# EAGLE design Macro_Mini_keypad (EAGLE 9.6.2)
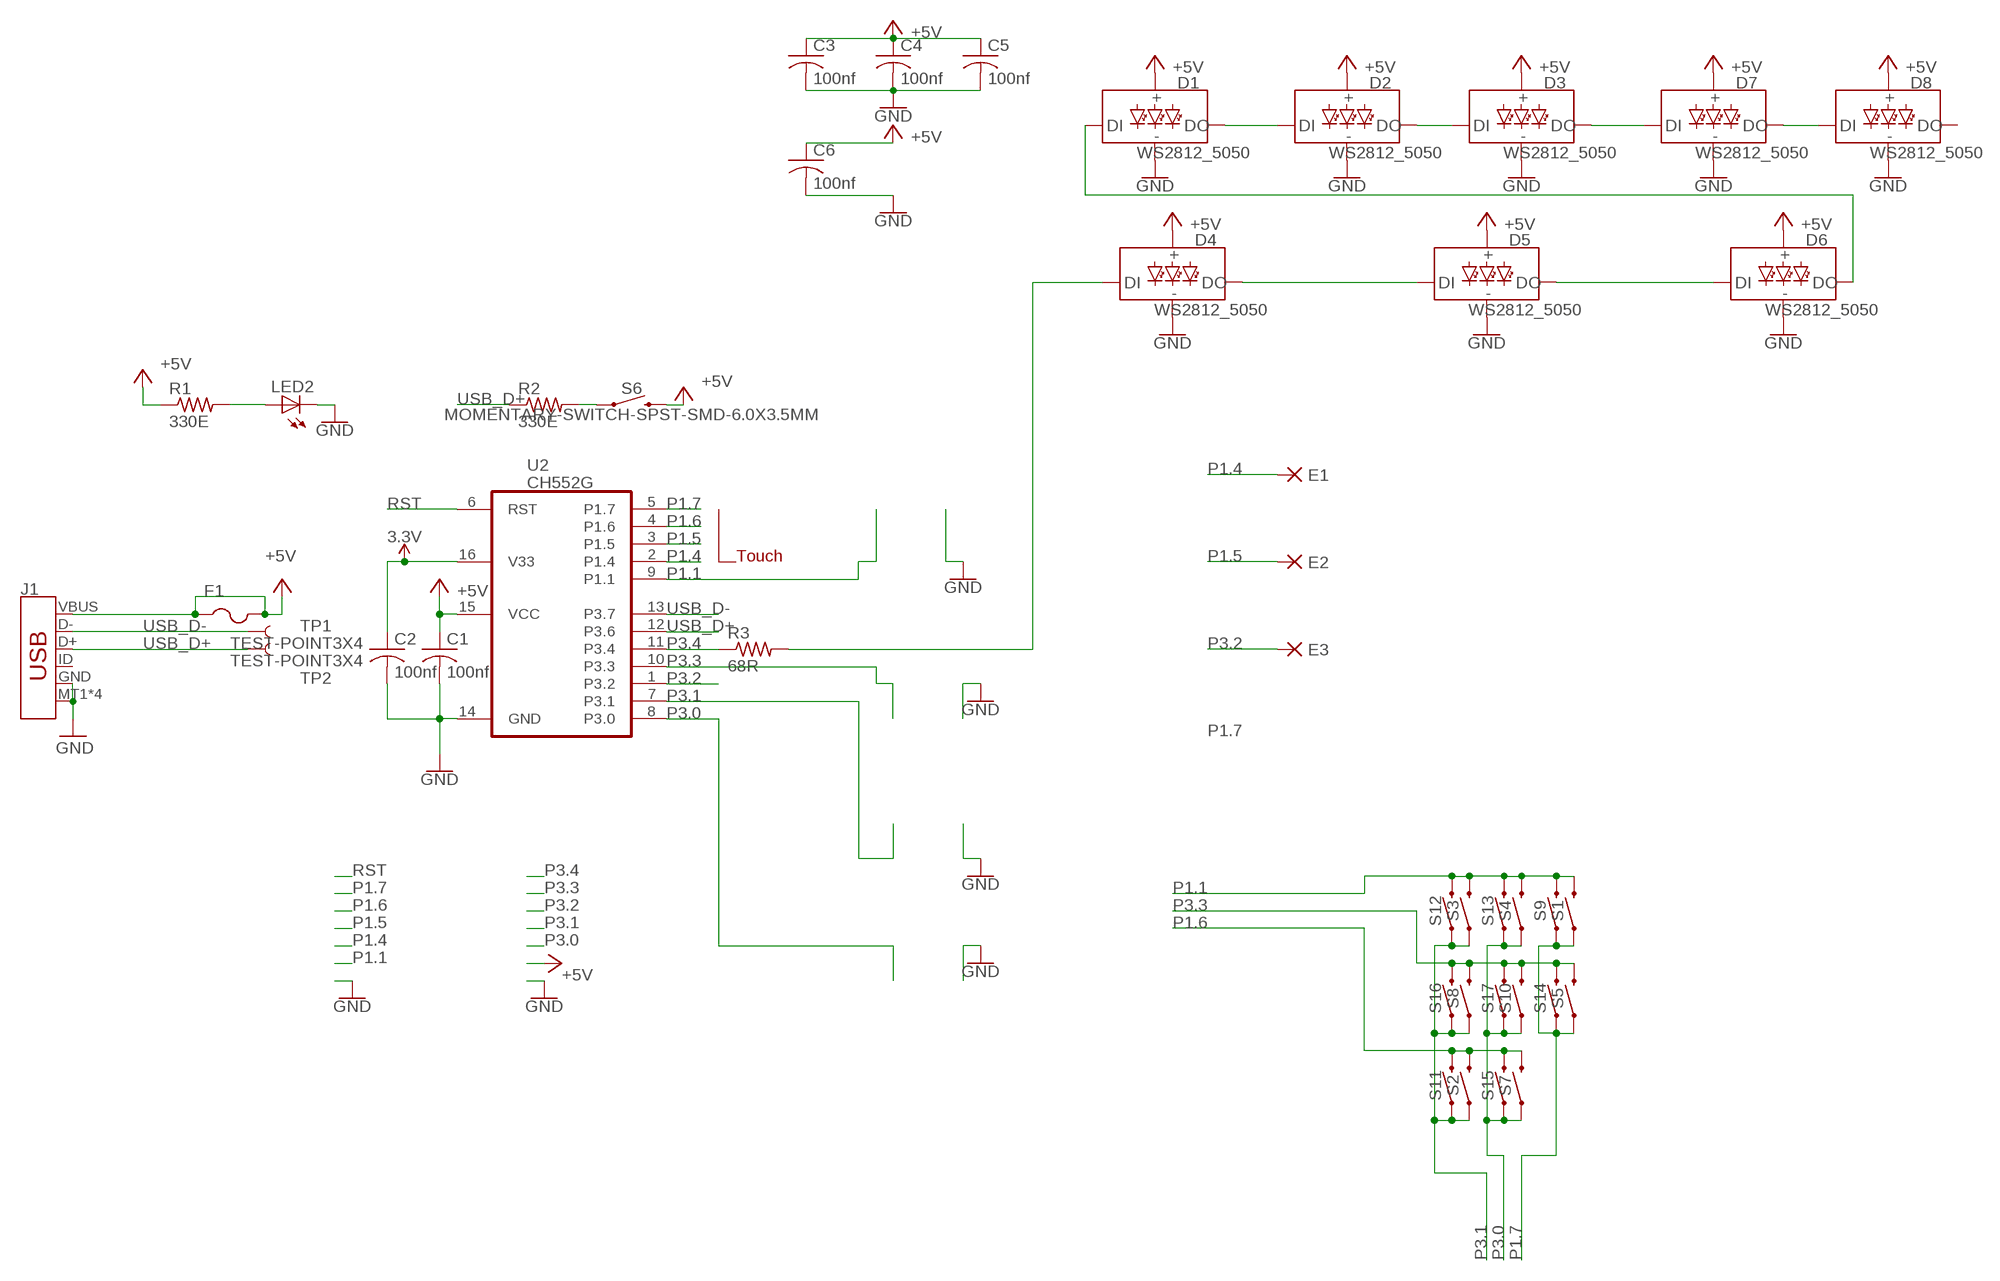
[diagram p0: schematic, sheet 1]

## Parts
C1  100nf  C-USC1206  [C1206]
C2  100nf  C-USC1206  [C1206]
C3  100nf  C-USC1206  [C1206]
C4  100nf  C-USC1206  [C1206]
C5  100nf  C-USC1206  [C1206]
C6  100nf  C-USC1206  [C1206]
D1  WS2812_5050  [WS2812-5X5-4PIN]
D2  WS2812_5050  [WS2812-5X5-4PIN]
D3  WS2812_5050  [WS2812-5X5-4PIN]
D4  WS2812_5050  [WS2812-5X5-4PIN]
D5  WS2812_5050  [WS2812-5X5-4PIN]
D6  WS2812_5050  [WS2812-5X5-4PIN]
D7  WS2812_5050  [WS2812-5X5-4PIN]
D8  WS2812_5050  [WS2812-5X5-4PIN]
E1  DPADS_PAD-0400-S  [DPADS_0400-S]
E2  DPADS_PAD-0400-S  [DPADS_0400-S]
E3  DPADS_PAD-0400-S  [DPADS_0400-S]
F1  PTCFUSE-1206  [R1206]
J1  USB_MICRO-B_SMT  [USB-MICROB]
LED2  LEDCHIPLED_1206  [CHIPLED_1206]
R1  330E  R-US_R1206  [R1206]
R2  330E  R-US_R1206  [R1206]
R3  68R  R-US_R1206  [R1206]
S1  MECHANICAL-KEYBOARD_CUSTOM1U  [CHERRY-MX-LED-1U]
S2  MECHANICAL-KEYBOARD_CUSTOM1U  [CHERRY-MX-LED-1U]
S3  MECHANICAL-KEYBOARD_CUSTOM1U  [CHERRY-MX-LED-1U]
S4  MECHANICAL-KEYBOARD_CUSTOM1U  [CHERRY-MX-LED-1U]
S5  MECHANICAL-KEYBOARD_CUSTOM1U  [CHERRY-MX-LED-1U]
S6  MOMENTARY-SWITCH-SPST-SMD-6.0X3.5MM  [TACTILE_SWITCH_SMD_6.0X3.5MM]
S7  MECHANICAL-KEYBOARD_CUSTOM1U  [CHERRY-MX-LED-1U]
S8  MECHANICAL-KEYBOARD_CUSTOM1U  [CHERRY-MX-LED-1U]
S9  MOMENTARY-SWITCH-SPST-PTH-12MM  [TACTILE_SWITCH_PTH_12MM]
S10  MECHANICAL-KEYBOARD_CUSTOM1U  [CHERRY-MX-LED-1U]
S11  MOMENTARY-SWITCH-SPST-PTH-12MM  [TACTILE_SWITCH_PTH_12MM]
S12  MOMENTARY-SWITCH-SPST-PTH-12MM  [TACTILE_SWITCH_PTH_12MM]
S13  MOMENTARY-SWITCH-SPST-PTH-12MM  [TACTILE_SWITCH_PTH_12MM]
S14  MOMENTARY-SWITCH-SPST-PTH-12MM  [TACTILE_SWITCH_PTH_12MM]
S15  MOMENTARY-SWITCH-SPST-PTH-12MM  [TACTILE_SWITCH_PTH_12MM]
S16  MOMENTARY-SWITCH-SPST-PTH-12MM  [TACTILE_SWITCH_PTH_12MM]
S17  MOMENTARY-SWITCH-SPST-PTH-12MM  [TACTILE_SWITCH_PTH_12MM]
TP1  TEST-POINT3X4  [PAD.03X.04]
TP2  TEST-POINT3X4  [PAD.03X.04]
U2  CH552G  MY_IC_CH551G_CH552GSOP-16  [MY_IC_SO16]

## Nets
3.3V: C2.1 U2.16(V33)
+5V: C1.1 C3.1 C4.1 C5.1 C6.1 D1.VCC D2.VCC D3.VCC D4.VCC D5.VCC D6.VCC D7.VCC D8.VCC F1.1 F1.2 J1.VBUS R1.1 S6.2 U2.15(VCC)
GND: C1.2 C2.2 C3.2 C4.2 C5.2 C6.2 D1.GND D2.GND D3.GND D4.GND D5.GND D6.GND D7.GND D8.GND J1.GND J1.MT1(SHIELD) J1.MT2(SHIELD) J1.P$1(SHIELD) J1.P$2(SHIELD) LED2.C U2.14(GND)
N$1: R2.2 S6.1
N$2: D4.DI R3.2
N$3: LED2.A R1.2
N$4: D4.DO D5.DI
N$5: D5.DO D6.DI
N$6: D1.DI D6.DO
N$7: D1.DO D2.DI
N$8: D2.DO D3.DI
N$9: D3.DO D7.DI
N$10: D7.DO D8.DI
P1.1: S1.S2 S3.S2 S4.S2 S9.3 S12.3 S13.3 U2.9(P1.1)
P1.4: E1.PAD(P) U2.2(P1.4)
P1.5: E2.PAD(P) U2.3(P1.5)
P1.6: S2.S2 S7.S2 S11.3 S15.3 U2.4(P1.6)
P1.7: S1.S1 S5.S1 S9.1 S14.1 U2.5(P1.7)
P3.0: S4.S1 S7.S1 S10.S1 S13.1 S15.1 S17.1 U2.8(P3.0)
P3.1: S2.S1 S3.S1 S8.S1 S11.1 S12.1 S16.1 U2.7(P3.1)
P3.2: E3.PAD(P) U2.1(P3.2)
P3.3: S5.S2 S8.S2 S10.S2 S14.3 S16.3 S17.3 U2.10(P3.3)
P3.4: R3.1 U2.11(P3.4)
RST: U2.6(RST)
USB_D+: J1.D+ R2.1 TP2.P$1 U2.12(P3.6)
USB_D-: J1.D- TP1.P$1 U2.13(P3.7)
Unconnected: D8.DO J1.ID

## Notes on the sheet
- Touch

## Library data of the parts
C1-C6 = adafruit:C-US: CAPACITOR, American symbol
D1-D8 = SparkFun-LED:WS2812: Addressable RGB LED - 1 Wire Common names: WS2812, SK6812, Neopixel, APA-106, etc. SMD LED with built-in controller IC. Color: Red/Green/Blue SparkFun Products: LED-SMD RGB (WS2812) <https://www.sparkfun.com/products/11821> LED - RGB Addressable, PTH, 5mm Diffused (5 Pack) <https://www.sparkfun.com/products/12986> LED - RGB Addressable, PTH, 5mm Clear (5 Pack) <https://www.sparkfun.com/products/12999> Blynk Board - ESP8266 <https://www.sparkfun.com/products/13794> Datasheet referenced for footprint: WS2812B-PTH <https://cdn.sparkfun.com/datasheets/Components/LED/COM-12877.pdf>; PROD_ID: DIO-12503
E1-E3 = 52101-101-REV-A_v16:DPADS_PAD: WIRE PAD Standard US Drill Sizes and SMD pads; BOM: EXCLUDE
F1 = adafruit:PTCFUSE: PTC fuses, resettable thermistors; LCSC: C151162
J1 = SparkFun-Connectors:USB_MICRO-B: USB Type Micro-B Connector Male/female and PTH/SMT variants SparkFun Products: SparkFun microB USB Breakout <https://www.sparkfun.com/products/12035> SparkFun USB microB Plug Breakout <https://www.sparkfun.com/products/10031> SparkFun ESP8266 Thing <https://www.sparkfun.com/products/13231>; PROD_ID: CONN-09505; SF_ID: PRT-08533
LED2 = adafruit:LED: LED OSRAM: - CHIPLED LG R971, LG N971, LY N971, LG Q971, LY Q971, LO R971, LY R971 LH N974, LH R974 LS Q976, LO Q976, LY Q976 LO Q996 - Hyper CHIPLED LW Q18S LB Q993, LB Q99A, LB R99A - SideLED LS A670, LO A670, LY A670, LG A670, LP A670 LB A673, LV A673, LT A673, LW A673 LH A674 LY A675 LS A676, LA A676, LO A676, LY A676, LW A676 LS A679, LY A679, LG A679 - Hyper Micro SIDELED® LS Y876, LA Y876, LO Y876, LY Y876 LT Y87S - SmartLED LW L88C, LW L88S LB L89C, LB L89S, LG L890 LS L89K, LO L89K, LY L89K LS L896, LA L896, LO L896, LY L896 - TOPLED LS T670, LO T670, LY T670, LG T670, LP T670 LSG T670, LSP T670, LSY T670, LOP T670, LYG T670 LG T671, LOG T671, LSG T671 LB T673, LV T673, LT T673, LW T673 LH T674 LS T676, LA T676, LO T676, LY T676, LB T676, LH T676, LSB T676, LW T676 LB T67C, LV T67C, LT T67C, LS T67K, LO T67K, LY T67K, LW E67C LS E67B, LA E67B, LO E67B, LY E67B, LB E67C, LV E67C, LT E67C LW T67C LS T679, LY T679, LG T679 LS T770, LO T770, LY T770, LG T770, LP T770 LB T773, LV T773, LT T773, LW T773 LH T774 LS E675, LA E675, LY E675, LS T675 LS T776, LA T776, LO T776, LY T776, LB T776 LHGB T686 LT T68C, LB T68C - Hyper Mini TOPLED® LB M676 - Mini TOPLED Santana® LG M470 LS M47K, LO M47K, LY M47K Source: http://www.osram.convergy.de/
R1-R3 = adafruit:R-US_: RESISTOR, American symbol
S1-S5 S7 S8 S10 = SparkFun-Switches:MECHANICAL-KEYBOARD_CUSTOM: Mechanical Keyboard Spacings for Cherry-MX Cherry-MX w/ LED switch footprints. Each package variant contains a bounding box on the tDocu layer for proper key spacing and a dimensional drawing on the Reference layer to be exported for laser cut mounting plates. Footprints are off-center so that the origin lies on the lower left corner of the key-spacing. This allows for most common layouts to be easily acheived on a grid spacing of 0.1875" Variants 1U through 1.75U in .25U steps Centered switch cutout in SwitchPlate layer with no stabilizers 2U through 2.75U in .25U steps Centered switch cutout in SwitchPlate layer with Cherry+Costar stabilizer holes 6.25U Common spacebar size Centered switch cutout in SwitchPlate layer with Cherry+Costar stabilizer holes "Big Ass" Enter ANSI 104 "Big Ass" Enter Key layout ISO Enter ISO style Enter Key layout
S6 = SparkFun-Switches:MOMENTARY-SWITCH-SPST: Momentary Switch (Pushbutton) - SPST; PROD_ID: SWCH-14278; SF_SKU: COM-08229
S9 S11-S17 = SparkFun-Switches:MOMENTARY-SWITCH-SPST: Momentary Switch (Pushbutton) - SPST; PROD_ID: SWCH-09185; SF_SKU: COM-09190
TP1 TP2 = SparkFun-Connectors:TEST-POINT: SparkFun Test Points Bare copper test points for troubleshooting or In-Circuit-Testing. These are used by our Production team for verifying production board runs using pogo-pins on test beds. SparkFun Products: SparkFun LSM9DS1 Breakout <https://www.sparkfun.com/products/13284> SparkFun PSOC <https://www.sparkfun.com/products/13714> SparkFun Load Cell Amplifier <https://www.sparkfun.com/products/13879>
U2 = myOwnLib:MY_IC_CH551G_CH552G; LCSC: C111292

## Board
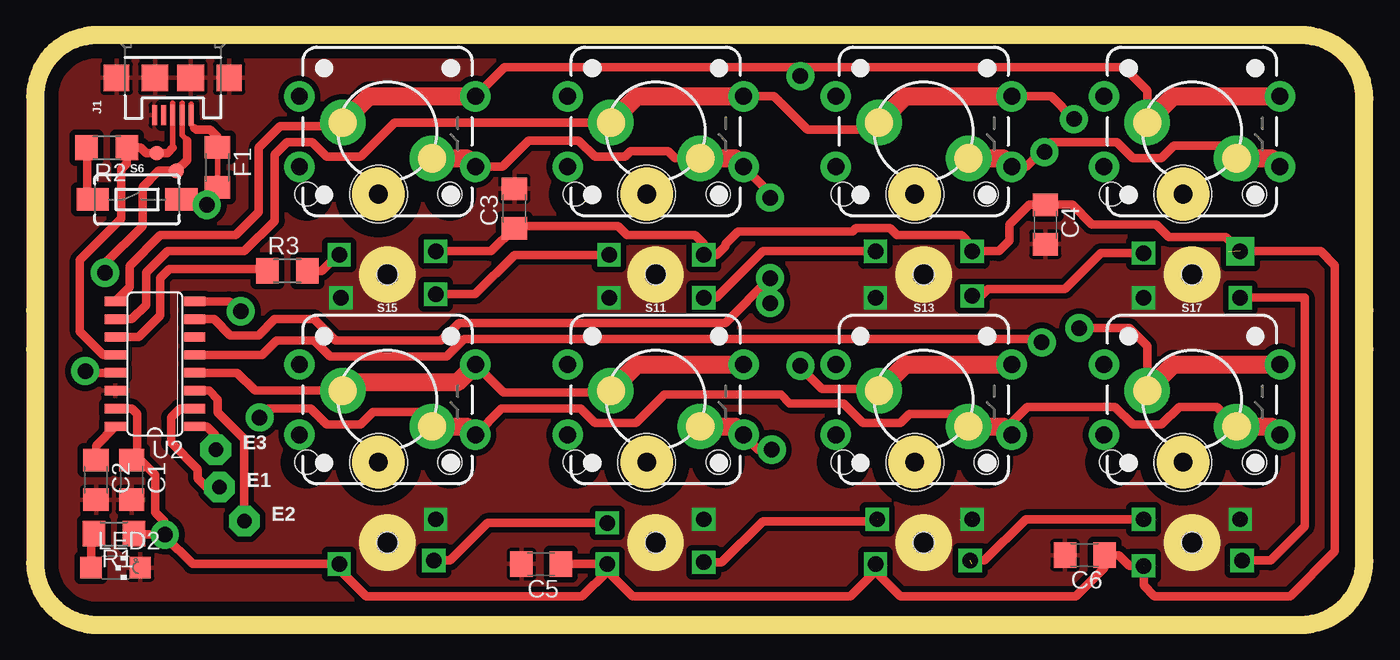
[diagram p1: board, top side]
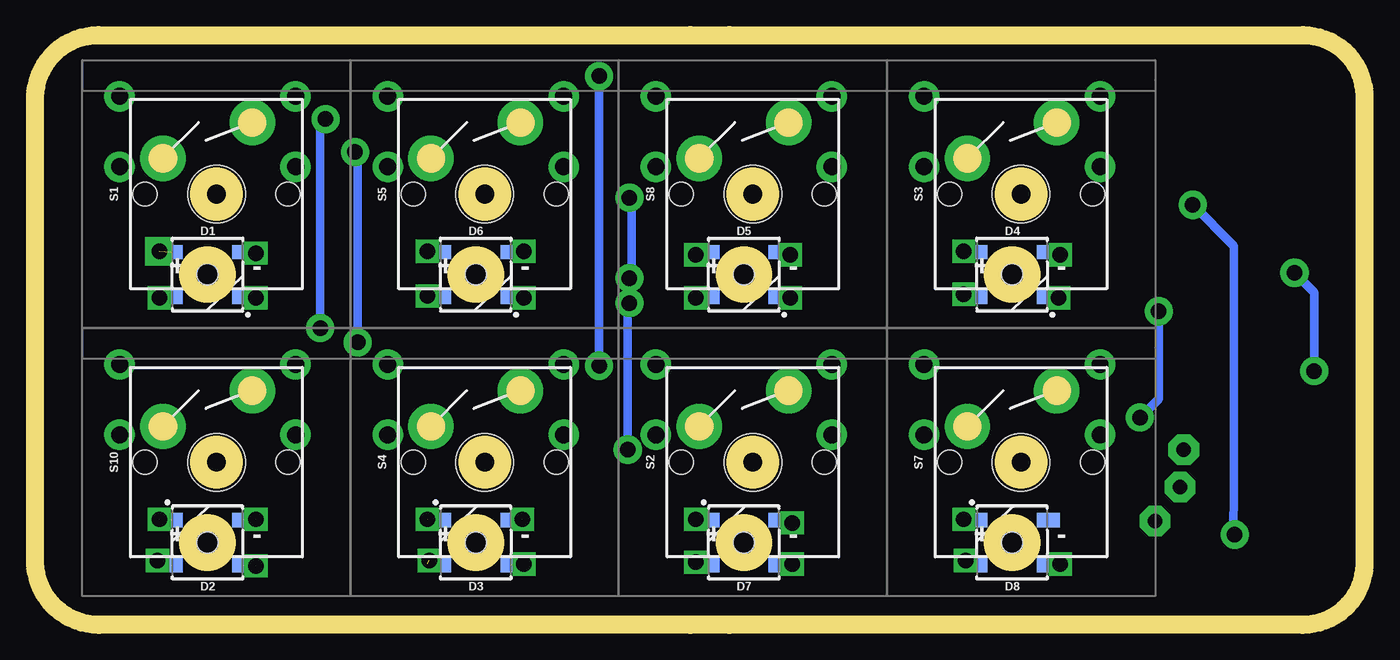
[diagram p2: board, bottom side, seen from below]

Size 94.41 x 41.9 mm. Coordinates in mm from the lower left corner, seen from the top.
Outline: 0,37.54 0,4.37 arc90 4.37,0 89.89,0 arc90 94.41,4.52 94.41,37.4 arc90 89.92,41.9 4.36,41.9 arc90 0,37.54
Copper layers (1*16): Top 0.035mm / dielectric 1.5mm / Bottom 0.035mm
Design rules "default *": minimum track width 0.3mm, minimum drill 1mm, track to track 0.3mm, track to pad 0.3mm, pad to pad 0.3mm, via to via 0.3mm, smd to smd 0.3mm, copper to edge 40mil, drill to drill 6mil, minimum pad ring 10mil, minimum via ring 8mil, stop-mask expansion 4mil, vias tented up to drill 0mil, thermal gap 10mil
Holes 1.5 mm at 25.02,5.84 44.07,5.84 63.12,5.84 82.17,5.84 82.17,24.89 63.12,24.89 44.07,24.89 25.02,24.89
Milling: area 23.6,4.4 to 26.4,7.2; area 42.7,4.4 to 45.5,7.2; area 61.7,4.4 to 64.5,7.2; area 80.8,4.4 to 83.6,7.2; area 80.8,23.5 to 83.6,26.3; area 61.7,23.5 to 64.5,26.3; area 42.7,23.5 to 45.5,26.3; area 23.6,23.5 to 26.4,26.3; area 23.1,29.3 to 25.7,31.9; area 42.2,29.3 to 44.7,31.9; area 61.2,29.3 to 63.8,31.9; area 80.3,29.3 to 82.8,31.9; 20 more areas; 12 lines

### Footprints (pad centres in the part's own frame; a part is rotated, then mirrored left to right if it is on the bottom)
C1206 = smd 1.6 x 1.8: 1 -1.4,0; 2 1.4,0
WS2812-5X5-4PIN = smd 1.651 x 1: DI 2.577,1.6; DO -2.577,-1.6; GND 2.577,-1.6; VCC -2.577,1.6
DPADS_0400-S = drill 1.016 pad 2.184 octagon: PAD 0,0
R1206 = smd 1.6 x 1.803: 1 -1.422,0; 2 1.422,0
USB-MICROB = smd 1.4 x 0.35: D+ -2.65,0; D- -2.65,-0.65; GND -2.65,1.3; ID -2.65,0.65; VBUS -2.65,-1.3 | smd 1.9 x 1.8: MT1 0,-4; MT2 0,4 | smd 1.9 x 1.9: P$1 0,-1.27; P$2 0,1.27
CHIPLED_1206 = smd 1.5 x 1.5: A 0,-1.75; C 0,1.75
CHERRY-MX-LED-1U = drill 1.753 pad 3.226: S1 5.715,12.065; S2 12.065,14.605 | hole 4.089: 9.525,9.525 | hole 1.707: 4.445,9.525; 14.605,9.525
TACTILE_SWITCH_SMD_6.0X3.5MM = smd 2.3 x 1.6: 1 -3.15,0; 2 3.15,0
TACTILE_SWITCH_PTH_12MM = drill 1.2 pad 2.159: 1 6.25,-2.5; 2 -6.25,-2.5; 3 6.25,2.5; 4 -6.25,2.5
PAD.03X.04 = smd 1.016 x 1.016: P$1 0,0
MY_IC_SO16 = smd 0.66 x 1.524: 1 -4.445,-2.819; 2 -3.175,-2.819; 3 -1.905,-2.819; 4 -0.635,-2.819; 5 0.635,-2.819; 6 1.905,-2.819; 7 3.175,-2.819; 8 4.445,-2.819; 9 4.445,2.819; 10 3.175,2.819; 11 1.905,2.819; 12 0.635,2.819; 13 -0.635,2.819; 14 -1.905,2.819; 15 -3.175,2.819; 16 -4.445,2.819

### Placement (x,y rotation side)
C1  6.86,10.29 270 top
C2  4.32,10.29 270 top
C3  34.04,29.59 90 top
C4  71.75,28.45 270 top
C5  35.94,4.32 180 top
C6  74.55,4.95 180 top
D1  82.17,24.89 0 bottom
D2  82.17,5.84 180 bottom
D3  63.12,5.84 180 bottom
D4  25.02,24.89 0 bottom
D5  44.07,24.89 0 bottom
D6  63.12,24.89 0 bottom
D7  44.07,5.84 180 bottom
D8  25.02,5.84 180 bottom
E1  13.08,9.78 0 top
E2  14.86,7.37 0 top
E3  12.83,12.45 0 top
F1  12.95,32.51 270 top
J1  9.78,38.86 90 top
LED2  5.71,4.06 270 top
R1  5.59,6.48 180 top
R2  5.08,33.91 180 top
R3  17.91,25.15 0 top
S1  91.06,21.08 0 bottom
S2  52.96,2.03 0 bottom
S3  33.91,21.08 0 bottom
S4  72.01,2.03 0 bottom
S5  72.01,21.08 0 bottom
S6  7.24,30.23 0 top
S7  33.91,2.03 0 bottom
S8  52.96,21.08 0 bottom
S9  82.17,35.05 0 top
S10  91.06,2.03 0 bottom
S11  44.07,16 0 top
S12  25.02,35.05 0 top
S13  63.12,16 0 top
S14  63.12,35.05 0 top
S15  25.02,16 0 top
S16  44.07,35.05 0 top
S17  82.17,16 0 top
TP1  10.03,32.26 0 top
TP2  8.64,33.53 0 top
U2  8.51,18.54 90 top

### Tracks (layer width: path | path; a pad name or v marks a point on that pad's centre or on a via)
3.3V
  Top 0.61: U2.16 4.32,12.72 C2.1
+5V  (via drill 1.1, 1.1 pad 2)  (5 unrouted)
  Top 0.406: 11.3,35.31 11.08,35.53 J1.VBUS 11.08,36.99 | F1.1 F1.2
  Top 0.61: U2.15 6.86,15.37 7.24,14.99 7.24,12.07 C1.1 7.49,11.69 8.51,10.67 8.51,8 9.21,7.3 v9.21,6.41 | 11.3,35.31 11.43,35.18 12.45,35.18 12.95,34.67 F1.1 | v28.45,26.54 32.39,26.54 C3.1 34.17,28.32 41.4,28.32 42.04,27.69 46.86,27.69 47.5,27.05 v47.5,26.29 48.39,26.29 49.02,26.92 49.02,27.05 49.91,27.94 58.04,27.94 58.29,28.19 60.71,28.19 61.21,27.69 65.79,27.69 66.55,26.92 v66.55,26.54 68.45,26.54 69.22,27.31 69.22,28.45 70.61,29.85 C4.1 73.66,29.85 75.06,28.45 79.63,28.45 80.52,27.56 84.58,27.56 v85.6,26.54 91.31,26.54 92.33,25.53 92.33,5.21 89.15,2.03 79.5,2.03 78.74,2.79 v78.74,4.19 77.72,4.19 76.96,4.95 C6.1 75.95,4.07 73.91,2.03 61.47,2.03 59.69,3.81 | 40.64,3.81 v40.64,4.32 C5.1 | 40.64,3.81 42.42,2.03 57.91,2.03 59.69,3.81 | 59.69,3.81 v59.69,4.32 | 40.64,3.81 38.86,2.03 23.5,2.03 21.59,3.94 v21.59,4.32 11.18,4.32 9.21,6.29 v9.21,6.41 | S6.2 10.77,29.85 v12.19,29.85 | 7.14,6.35 R1.1 7.07,6.41 v9.21,6.41
  Top 0.813: F1.2 12.09,30.23 S6.2
  Bottom 0.61: D8.VCC 21.67,4.24 v21.59,4.32 | D7.VCC 40.72,4.24 v40.64,4.32 | D3.VCC 59.77,4.24 v59.69,4.32 | D2.VCC 78.79,4.24 v78.74,4.19 | D4.VCC 28.4,26.49 v28.45,26.54 | D6.VCC 66.5,26.49 v66.55,26.54 | D5.VCC 47.3,26.49 v47.5,26.29 | v12.19,29.85 9.27,26.92 9.27,8.51 9.35,6.68 v9.21,6.41
GND  (via drill 1.1)  (4 unrouted)
  Bottom 0.61: D4.GND 22.39,23.24 v21.72,23.24 | D5.GND 41.44,23.24 v40.77,23.24 | D6.GND 59.74,23.29 v59.69,23.24 | D1.GND 78.79,23.29 v78.74,23.24 | D2.GND 84.8,7.49 v85.6,7.49 | D3.GND 66.5,7.44 v66.55,7.49 | D7.GND 47.45,7.44 v47.5,7.49 | D8.GND 27.65,7.49 v28.45,7.49
  pour Top (isolate 0.406): -1.78,-1.91 -1.78,47.62 132.84,47.62 132.84,-1.91
N$1
  Top 0.61: S6.1 3.68,30.63 3.68,33.88 R2.2
N$2  (via drill 1.1)
  Top 0.61: v21.59,26.29 21.49,26.29 20.34,25.15 R3.2
  Bottom 0.61: D4.DI 21.79,26.49 v21.59,26.29
N$3
  Top 0.61: R1.2 3.96,6.28 LED2.A
N$4  (via drill 1.1)
  Top 0.61: v40.77,26.29 34.04,26.29 31.24,23.5 v28.45,23.5
  Bottom 0.61: D4.DO 28.25,23.29 v28.45,23.5 | D5.DI 40.97,26.49 v40.77,26.29
N$5  (via drill 1.1)
  Top 0.61: v47.5,23.24 48.39,23.24 51.69,26.54 v59.69,26.54
  Bottom 0.61: D5.DO 47.45,23.29 v47.5,23.24 | v59.69,26.54 60.49,26.54 D6.DI
N$6  (via drill 1.1)
  Top 0.61: v66.55,23.37 67.18,23.37 67.69,23.88 73.15,23.88 75.69,26.42 v78.74,26.42
  Bottom 0.61: D6.DO 66.47,23.29 v66.55,23.37 | v78.74,26.42 78.82,26.49 D1.DI
N$7  (via drill 1.1)  (1 unrouted)
  Top 0.61: v85.6,23.24 90.17,23.24 90.17,6.98 87.76,4.57 v85.72,4.57
  Bottom 0.61: D1.DO 85.55,23.29 v85.6,23.24 | v85.72,4.57 85.39,4.24 D2.DI
N$8  (via drill 1.1)  (3 unrouted)
  Top 0.61: v78.74,7.49 70.36,7.49 67.44,4.57 v66.42,4.57
  Bottom 0.61: D2.DO 78.79,7.44 v78.74,7.49 | 66.55,4.32 65.77,4.32 D3.DI
N$9  (via drill 1.1)  (1 unrouted)
  Top 0.61: v59.82,7.49 59.69,7.37 51.69,7.37 48.77,4.45 v47.5,4.45
  Bottom 0.61: D3.DO 59.87,7.44 v59.82,7.49 | v47.5,4.45 46.85,4.45 D7.DI
N$10  (via drill 1.1)
  Top 0.61: v40.64,7.24 32.13,7.24 29.46,4.57 v28.32,4.57
  Bottom 0.61: D7.DO 40.97,7.44 40.77,7.24 v40.64,7.24 | v28.32,4.57 27.93,4.57 D8.DI
P1.1  (via drill 1.1 pad 2)
  Top 0.61: U2.9 6.71,24 6.71,25.5 8.89,27.69 14.22,27.69 15.88,29.34 15.88,33.91 17.4,35.43 21.59,35.43 S3.S2 | S12.3 33.34,39.62 54.48,39.62 | S1.S2 78.99,37.97 77.34,39.62 54.48,39.62 | S4.S2 59.82,16.76 55.88,16.76 54.36,18.29 v54.36,18.42 | v54.36,38.99 54.36,39.5 54.48,39.62
  Top 1.27: S3.S2 23.71,37.55 S12.3 | S1.S2 80.86,37.55 S9.3 | S4.S2 61.81,18.5 S13.3
  Bottom 0.61: v54.36,18.42 v54.36,38.99
P1.4
  Top 0.61: U2.2 10.29,15.37 9.65,14.73 9.65,12.95 11.56,11.05 11.56,10.41 12.19,9.78 E1.PAD
P1.5
  Top 0.61: E2.PAD 14.86,13.21 12.98,15.09 12.98,16 12.34,16.64 U2.3
P1.6
  Top 0.61: U2.4 14.35,17.91 15.62,16.64 S7.S2 | S15.3 33.26,16.51 40.77,16.51 S2.S2
  Top 1.27: S7.S2 22.44,17.23 30,17.23 S15.3 | S2.S2 42.76,18.5 S11.3
P1.7  (via drill 1.1 pad 2)
  Top 0.61: S14.1 70.4,32.55 71.44,33.59 v71.69,33.59 71.69,33.85 72.14,34.29 76.83,34.29 77.98,33.15 80.01,33.15 80.9,34.04 84.45,34.04 S1.S1 | U2.5 16.13,19.18 17.14,20.19 19.81,20.19 20.96,19.05 29.21,19.05 30.48,20.32 71.25,20.32 v71.5,20.07
  Top 1.27: S5.S1 68.77,33.15 S14.1 | S1.S1 87.82,33.15 S9.1
  Bottom 0.61: v71.69,33.59 71.5,33.4 v71.5,20.07
P3.0  (via drill 1.1 pad 2)
  Top 0.61: S10.S1 83.95,15.49 81.28,15.49 80.01,14.22 77.98,14.22 76.71,15.49 70.48,15.49 69.34,14.35 69.34,13.53 S13.1 | S15.1 33.13,15.37 38.73,15.37 39.75,14.35 42.67,14.35 44.7,16.38 52.96,16.38 53.59,15.75 57.4,15.75 58.8,14.35 61.47,14.35 62.1,14.99 65.41,14.99 S4.S1 | U2.8 13.78,22.99 14.48,22.29 v14.61,22.29 | v15.94,14.73 16.57,15.37 19.56,15.37 20.7,14.22 23.11,14.22 24,15.11 27.18,15.11 S7.S1
  Top 1.27: S7.S1 30.67,14.1 S15.1 | S4.S1 68.77,14.1 S13.1 | S10.S1 87.82,14.1 S17.1
  Bottom 0.61: v14.61,22.29 14.61,16.06 v15.94,14.73
P3.1  (via drill 1.1 pad 2)
  Top 0.61: S12.1 33.19,32.55 35.05,34.42 38.61,34.42 39.75,33.27 41.91,33.27 42.29,33.66 44.96,33.66 45.47,33.15 S8.S1 | v52.2,30.35 52.2,30.67 S16.1 | S11.1 51.38,12.45 v52.32,12.45 | v52.2,22.86 v52.2,24.64 49.02,21.46 30.1,21.46 28.83,20.19 21.34,20.19 19.81,21.72 17.02,21.72 15.88,20.57 13.84,20.57 12.7,21.72 U2.7
  Top 1.27: S3.S1 30.67,33.15 S12.1 | S8.S1 49.72,33.15 S16.1 | S2.S1 49.72,14.1 S11.1
  Bottom 0.61: v52.2,30.35 52.07,30.23 52.07,25.27 52.2,25.15 v52.2,24.64 | v52.32,12.45 52.32,22.73 v52.2,22.86
P3.2
  Top 0.61: E3.PAD 12.83,13.46 12.19,14.1 U2.1
P3.3  (via drill 1.1 pad 2)
  Top 0.61: U2.10 6.86,21.72 7.87,22.73 7.87,25.02 9.4,26.54 14.86,26.54 17.02,28.7 17.02,33.4 17.91,34.29 19.68,34.29 20.7,33.27 23.11,33.27 25.53,35.69 S8.S2 | S16.3 52.49,37.55 54.86,35.18 59.44,35.18 S5.S2 | S10.S2 78.99,19.81 77.72,21.08 v74.17,21.08 | v73.79,35.94 72.18,37.55 S14.3
  Top 1.27: S8.S2 42.76,37.55 S16.3 | S5.S2 61.81,37.55 S14.3 | S10.S2 80.86,18.5 S17.3
  Bottom 0.61: v74.17,21.08 74.17,35.56 v73.79,35.94
P3.4
  Top 0.61: U2.11 7.37,20.45 8.89,21.97 8.89,24.64 9.53,25.27 16.36,25.27 R3.1
USB_D+
  Top 0.406: 9.78,33.91 J1.D+ 9.78,37.08
  Top 0.61: 8.51,33.4 TP2.P$1 | 9.78,33.91 9.4,33.53 TP2.P$1 | U2.12 4.83,19.18 3.17,20.83 3.17,25.91 6.12,28.85 6.12,32.38 6.5,32.77 R2.1 7.49,33.91 7.87,33.53 TP2.P$1
USB_D-  (via drill 1.1 pad 2)
  Top 0.406: 10.79,34.42 10.43,34.78 J1.D- 10.43,37.07
  Top 0.61: 10.79,34.42 10.79,33.02 TP1.P$1 8.76,32.26 7.62,31.12 7.62,28.32 4.95,25.65 v4.95,25.02 | U2.13 3.68,17.91 v3.56,18.03
  Bottom 0.61: v4.95,25.02 3.56,23.62 v3.56,18.03